# EasyEDA Pro project Complete_project.epro, board PCB7
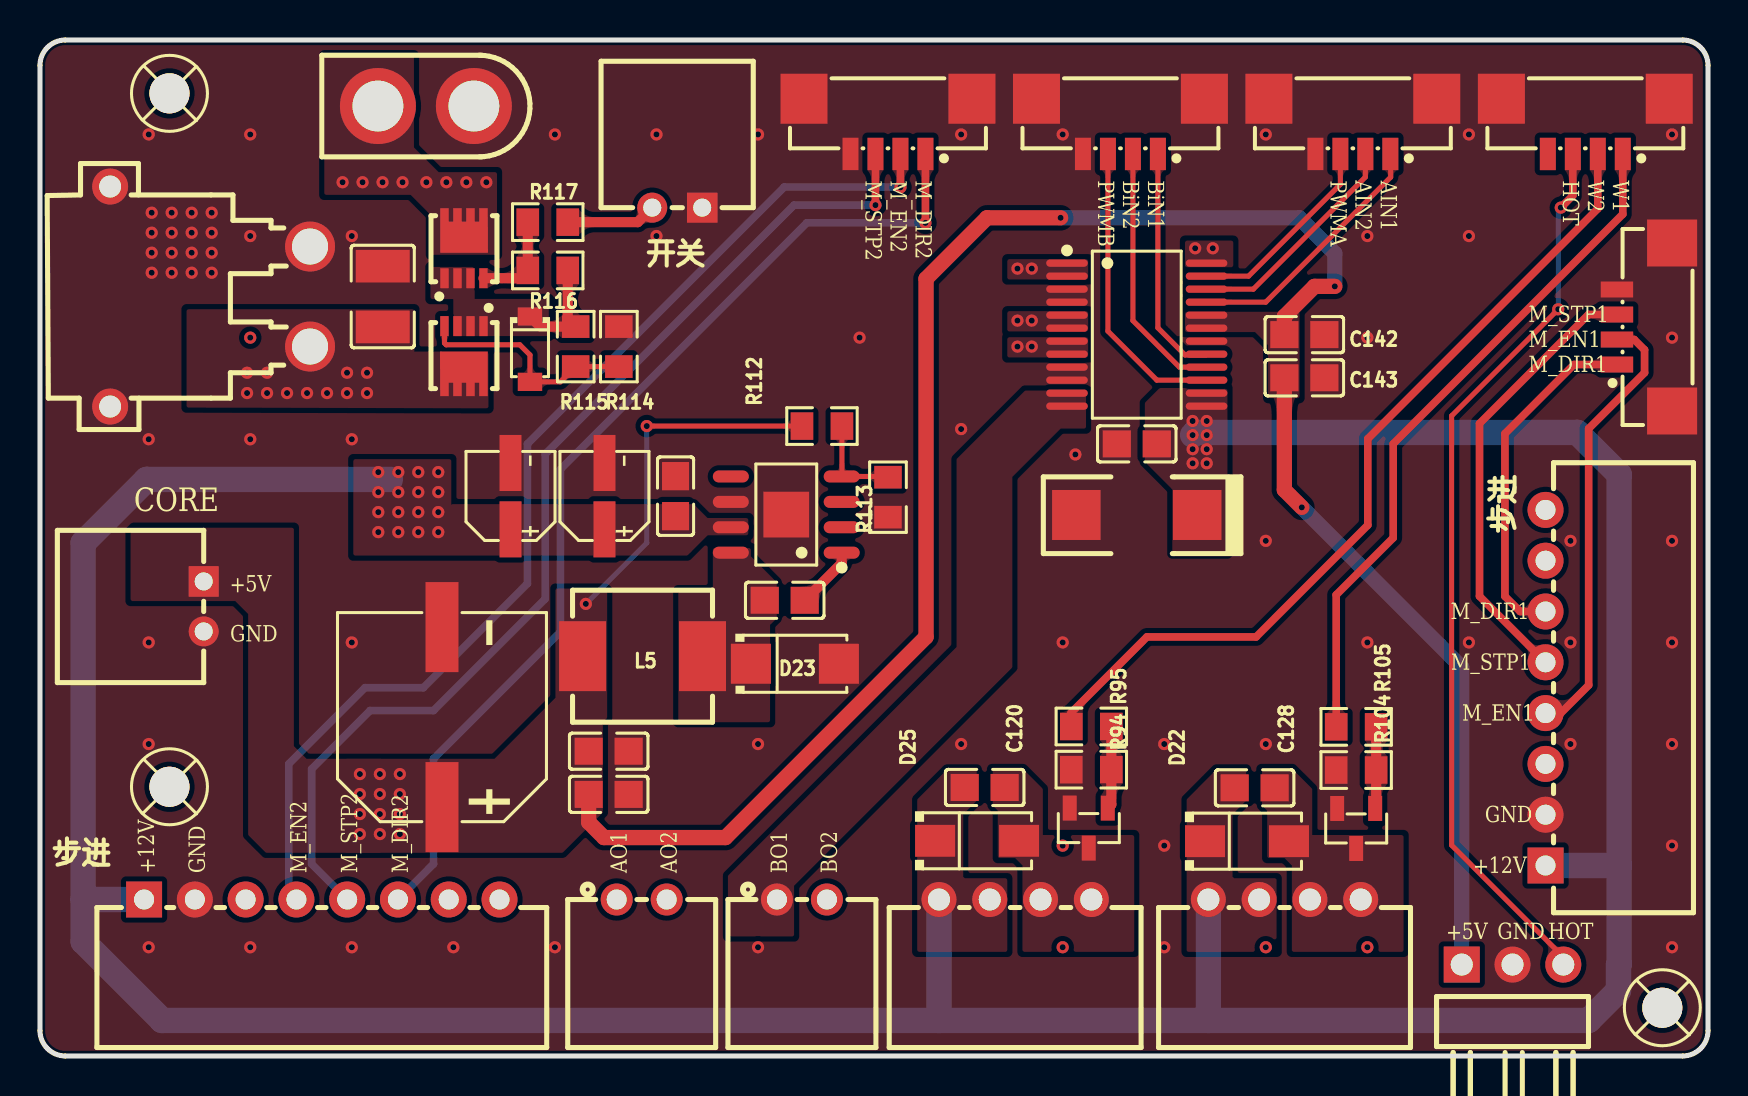
[diagram p18: board, top side]
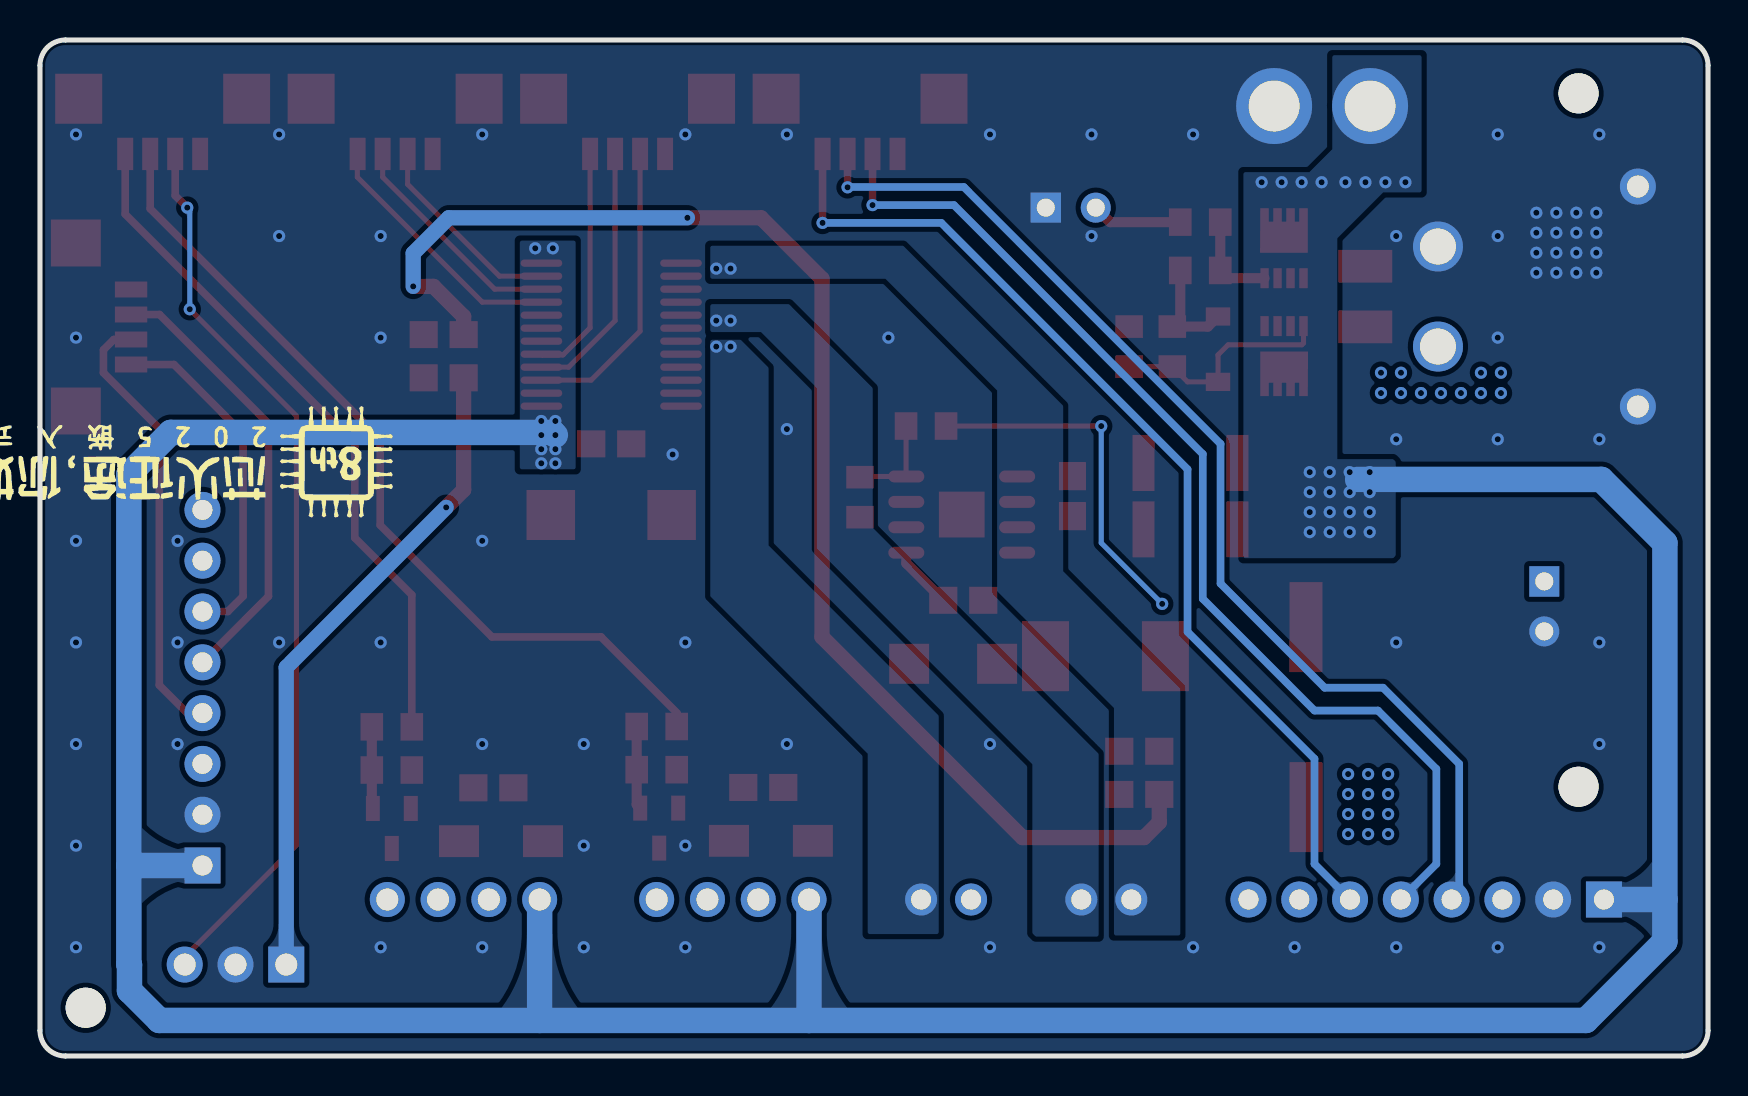
[diagram p19: board, bottom side, seen from below]

Outline 83.44 x 50.8 mm; copper layers: Top Layer, Bottom Layer. Coordinates in mm from the lower left corner of the outline.
Outline path: 0,49.53 0,1.27 arc(0.37,0.37) 1.27,0 82.17,0 arc(83.07,0.37) 83.44,1.27 83.44,49.53 arc(83.07,50.43) 82.17,50.8 1.27,50.8 arc(0.37,50.43) 0,49.53
Stack: Top Layer 0.035mm / Dielectric1 1.51mm FR4 er 4.5 / Bottom Layer 0.035mm

## Design rules (mm)
template: 自定义配置
spacing copperThickness1oz (default): track to track 0.102, other pairs 0.152 to 0.3
spacing copperThickness2oz: track to track 0.203, other pairs 0.152 to 0.3
track width copperThickness1oz (default): min 0.127, default 0.254, max 2.54
track width copperThickness2oz: min 0.203, default 0.254, max 2.54
differential pair differentialPair (default): width min 0.127, default 0.254, max 2.54; gap min 0.152, default 0.152
via viaSize (default): diameter min 0.5, default 0.61, max 10; hole min 0.3, default 0.305, max 6.3

## Placement (name value [footprint] x y rotation side)
C29  10uF  [CASE-C_6032]  54.86 27.05 0 top
C32  100nF  [C0805]  54.86 30.61 0 top
C120  100nF  [C0805]  47.26 13.43 180 top
C128  100nF  [C0805]  60.76 13.41 180 top
C131  4.7uF  [CAP-SMD_BD4.0-L4.3-W4.3-LS5.0-FD]  28.24 27.99 90 top
C132  100nF  [C0805]  31.79 27.99 270 top
C134  100nF  [C0805]  28.45 13.08 180 top
C135  470uF  [CAP-SMD_BD10.0-L10.3-W10.3-LS11.3-FD]  20.11 16.94 90 top
C136  100nF  [C0805]  28.45 15.24 180 top
C137  4.7uF  [CAP-SMD_BD4.0-L4.3-W4.3-LS5.0-FD]  23.54 27.99 90 top
C139  100nF  [C0805]  37.25 22.79 180 top
C141  100nF  [C1210]  17.14 37.97 90 top
C142  100nF  [C0805]  63.25 36.07 180 top
C143  100nF  [C0805]  63.25 33.91 180 top
CN16  ZX-XH2.54-2PWZ  [CONN-TH_2P-P2.50_ZX-XH2.54-2PWZ]  31.88 42.42 180 top
CN17  XT30PW-M30.G.Y  [CONN-TH_XT30PW-M]  8.51 37.97 270 top
CN113  HC-1.25-4PLT  [CONN-SMD_4P-P1.25_HCTL_HC-1.25-4PLT]  77.3 46.48 180 top
CN114  HC-1.25-4PLT  [CONN-SMD_4P-P1.25_HCTL_HC-1.25-4PLT]  65.67 46.48 180 top
CN115  HC-1.25-4PLT  [CONN-SMD_4P-P1.25_HCTL_HC-1.25-4PLT]  54.05 46.48 180 top
CN116  HC-1.25-4PLT  [CONN-SMD_4P-P1.25_HCTL_HC-1.25-4PLT]  80.26 36.45 90 top
CN117  HC-1.25-4PLT  [CONN-SMD_4P-P1.25_HCTL_HC-1.25-4PLT]  42.42 46.48 180 top
CN118  XH-2AW  [CONN-TH_XH-2AW_C2908611]  30.1 7.82 0 top
CN119  XH-2AW  [CONN-TH_XH-2AW_C2908611]  38.11 7.82 0 top
core1  ZX-XH2.54-2PWZ  [CONN-TH_2P-P2.50_ZX-XH2.54-2PWZ]  8.19 22.48 270 top
D22  SS34  [SMA_L4.3-W2.5-LS5.0-RD]  60.38 10.74 0 top
D23  SS56  [SMA_L4.3-W2.6-LS5.2-RD]  37.76 19.61 0 top
D24  BZT52C27  [SOD-123_L2.7-W1.6-LS3.7-RD]  24.51 35.34 270 top
D25  SS34  [SMA_L4.3-W2.5-LS5.0-RD]  46.88 10.76 0 top
H1  PZ254R-11-03P  [HDR-TH_3P-P2.54-H-M-W10.4]  73.66 4.57 0 top
L5  10uH  [IND-SMD_L7.3-W6.8]  30.14 19.99 180 top
Q21  AON7401-MS  [POWERDI3333-8_DMN7022LFGQ-7]  21.21 35.47 180 top
Q22  AON7401-MS  [POWERDI3333-8_DMN7022LFGQ-7]  21.21 39.91 0 top
Q23  -  [SOT-23-3_L2.9-W1.3-P1.90-LS2.4-BR]  65.84 11.38 90 top
Q24  -  [SOT-23-3_L2.9-W1.3-P1.90-LS2.4-BR]  52.46 11.4 90 top
R94  1k  [R0805]  52.59 14.32 0 top
R95  20  [R0805]  52.59 16.48 0 top
R104  1k  [R0805]  65.84 14.3 0 top
R105  20  [R0805]  65.84 16.46 0 top
R112  6.8K  [R0805]  39.12 31.5 180 top
R113  2.2K  [R0805]  42.42 27.94 90 top
R114  10K  [R0805]  28.96 35.47 270 top
R115  10K  [R0805]  26.8 35.47 270 top
R116  100K  [R0805]  25.4 39.28 180 top
R117  100R  [R0805]  25.4 41.69 0 top
SCREW1  -  [M2螺丝]  6.48 48.13 0 top
SCREW2  -  [M2螺丝]  6.48 13.46 0 top
SCREW3  -  [M2螺丝]  81.15 2.41 0 top
STEP2  XH-8AW  [CONN-TH_8P-P2.54_HCTL_XH-8AW_C2908617]  75.31 18.41 90 top
STEP3  XH-8AW  [CONN-TH_8P-P2.54_HCTL_XH-8AW_C2908617]  14.1 7.82 0 top
U1  TB6612FNG(O,C,8,EL  [SSOP-24_L8.4-W5.8-P0.65-LS7.8-BL]  54.86 36.07 270 top
U50  TPS5450DDAR  [SOP-8_L4.9-W3.9-P1.27-LS6.0-BL-EP]  37.33 27.07 90 top
U51  XT30U-F  [CONN-TH_XT30U-F]  19.3 47.5 0 top
WATER1  XH-4AW  [CONN-TH_XH-4AW]  62.26 7.82 0 top
WATER2  XH-4AW  [CONN-TH_XH-4AW]  48.78 7.82 0 top

## Footprints (pads in the part's own frame, mm; a bottom-side part is the same pattern mirrored in y, then rotated)
C0805
  rect 1.41x1.35 smd: 1(-1,0) 2(1,0)
C1210
  rect 1.635x2.7 smd: 1(-1.518,0) 2(1.518,0)
CAP-SMD_BD4.0-L4.3-W4.3-LS5.0-FD
  rect 2.8x1.1 smd: 1(-1.661,0) 2(1.661,0)
CAP-SMD_BD10.0-L10.3-W10.3-LS11.3-FD
  rect 4.5x1.65 smd: 1(-4.5,0) 2(4.5,0)
CASE-C_6032
  rect 2.425x2.5 smd: 1(3.022,0) 2(-3.022,0)
CONN-SMD_4P-P1.25_HCTL_HC-1.25-4PLT
  rect 0.8x1.62 smd: 1(-1.875,1.38) 2(-0.625,1.38) 3(0.625,1.38) 4(1.875,1.38)
  rect 2.35x2.5 smd: 5(-4.2,-1.38) 6(4.2,-1.38)
CONN-TH_2P-P2.50_ZX-XH2.54-2PWZ
  rect 1.524x1.5 hole 0.9: 1(-1.25,0)
  round 1.5 hole 0.9: 2(1.25,0)
CONN-TH_8P-P2.54_HCTL_XH-8AW_C2908617
  rect 1.8x1.8 hole 1: 1(-8.89,0)
  round 1.8 hole 1: 2(-6.35,0) 3(-3.81,0) 4(-1.27,0) 5(1.27,0) 6(3.81,0) 7(6.35,0) 8(8.89,0)
CONN-TH_XH-2AW_C2908611
  round 1.6 hole 1: 1(-1.25,0) 2(1.25,0)
CONN-TH_XH-4AW
  round 1.75 hole 1.1: 1(-3.81,0) 2(-1.27,0) 3(1.27,0) 4(3.81,0)
CONN-TH_XT30PW-M
  round 2.5 hole 1.8: 1(-2.5,5) 2(2.5,5)
  round 1.8 hole 1.1: 3(5.5,-5) 4(-5.5,-5)
CONN-TH_XT30U-F
  round 3.8 hole 2.54: 1(2.4,0) 2(-2.4,0)
HDR-TH_3P-P2.54-H-M-W10.4
  rect 1.8x1.8 hole 1.1: 1(-2.54,0)
  round 1.8 hole 1.1: 2(0,0) 3(2.54,0)
IND-SMD_L7.3-W6.8
  rect 2.35x3.5 smd: 1(-3,0) 2(3,0)
M2螺丝
  round 2 hole 2: 1(0,0)
POWERDI3333-8_DMN7022LFGQ-7
  rect 0.42x1 smd: 1(-0.975,-1.025) 2(-0.325,-1.025) 3(0.325,-1.025) 4(0.975,-1.025)
  custom 0x0 smd: 5(0.005,1.025)
R0805
  rect 1.133x1.377 smd: 1(-1,0) 2(1,0)
SMA_L4.3-W2.5-LS5.0-RD
  rect 2x1.593 smd: 1(-2.1,0) 2(2.1,0)
SMA_L4.3-W2.6-LS5.2-RD
  rect 2x2 smd: 1(-2.2,0) 2(2.2,0)
SOD-123_L2.7-W1.6-LS3.7-RD
  rect 0.91x1.22 smd: 1(-1.635,0) 2(1.635,0)
SOP-8_L4.9-W3.9-P1.27-LS6.0-BL-EP
  oval 0.6x1.8 smd: 1(-1.905,-2.772) 2(-0.635,-2.772) 3(0.635,-2.772) 4(1.905,-2.772) 5(1.905,2.772) 6(0.635,2.772) 7(-0.635,2.772) 8(-1.905,2.772)
  rect 2.29x2.29 smd: 9(0,0)
SOT-23-3_L2.9-W1.3-P1.90-LS2.4-BR
  rect 1.25x0.7 smd: 1(1,-0.95) 2(1,0.95) 3(-1,0)
SSOP-24_L8.4-W5.8-P0.65-LS7.8-BL
  oval 0.364x2.082 smd: 1(-3.575,-3.491) 2(-2.925,-3.491) 3(-2.275,-3.491) 4(-1.625,-3.491) 5(-0.975,-3.491) 6(-0.325,-3.491) 7(0.325,-3.491) 8(0.975,-3.491) 9(1.625,-3.491) 10(2.275,-3.491) 11(2.925,-3.491) 12(3.575,-3.491) 13(3.575,3.491) 14(2.925,3.491) 15(2.275,3.491) 16(1.625,3.491) 17(0.975,3.491) 18(0.325,3.491) 19(-0.325,3.491) 20(-0.975,3.491) 21(-1.625,3.491) 22(-2.275,3.491) 23(-2.925,3.491) 24(-3.575,3.491)

## Nets
As in the schematic.

Pads without a net: SCREW1 1; SCREW2 1; SCREW3 1; STEP2 3 7 8; STEP3 3 7 8; U50 2 3 5

## Via types
v1: diameter 0.61, hole 0.305, Top Layer to Bottom Layer, 144 vias

## Routing (per net, layer and track width the routed paths; a pad name or vN(x,y) marks a point on that pad's centre or on a via; arc(x,y) is an arc through that point)
+5V: length 119.7
  Top Layer w0.254: R112.2 v1(30.35,31.5)
  Top Layer w0.762: C134.2 27.45,11.68 28.21,10.92 34.29,10.92 44.32,20.95 44.32,38.86 47.37,41.91 v1(51.05,41.91) ; v1(64.77,38.48) 63.75,38.48 62.25,36.97 C142.2 ; v1(63.12,27.43) 62.25,28.3 C143.2
  Bottom Layer w0.254: v1(30.35,31.5) 30.35,25.65 v1(27.31,22.61)
  Bottom Layer w0.762: H1.1 71.12,19.43 v1(63.12,27.43) ; v1(64.77,38.48) 64.77,40.13 62.99,41.91 v1(51.05,41.91)
  vias: v1(16,14.1) v1(16,13.1) v1(16,12.1) v1(16,11.1) v1(17,14.1) v1(17,13.1) v1(17,12.1) v1(17,11.1) v1(18,14.1) v1(18,13.1) v1(18,12.1) v1(18,11.1)
+12V: length 182.6
  Bottom Layer w1.27: 17.53,28.83 5.33,28.83 2.16,25.65 2.16,7.82 ; STEP3.1 2.16,7.82 ; 2.16,7.82 2.16,5.72 6.11,1.78 44.97,1.78 ; v1(57.66,31.04) 57.79,31.18 76.9,31.18 78.99,29.08 78.99,9.52 ; WATER1.1 58.45,1.78 ; 44.97,1.78 77.47,1.78 78.96,3.27 78.96,4.56 78.99,4.59 78.99,9.52 ; 44.97,1.78 WATER2.1 ; STEP2.1 78.99,9.52
  vias: v1(15.14,43.69) v1(16.14,43.69) v1(16.92,29.19) v1(16.92,28.19) v1(16.92,27.19) v1(16.92,26.19) v1(17.14,43.69) v1(17.92,29.19) v1(17.92,28.19) v1(17.92,27.19) v1(17.92,26.19) v1(18.14,43.69) v1(18.92,29.19) v1(18.92,28.19) v1(18.92,27.19) v1(18.92,26.19) v1(19.33,43.69) v1(19.92,29.19) v1(19.92,28.19) v1(19.92,27.19) v1(19.92,26.19) v1(20.33,43.69) v1(21.33,43.69) v1(22.33,43.69) v1(57.66,31.75) v1(57.66,30.34) v1(57.66,29.63) v1(57.78,40.39) v1(58.36,31.75) v1(58.36,31.04) v1(58.36,30.34) v1(58.36,29.63) v1(58.67,40.39)
GND:
  vias: v1(5.44,46.08) v1(5.44,30.84) v1(5.44,20.68) v1(5.44,15.6) v1(5.44,5.44) v1(5.59,42.16) v1(5.59,41.16) v1(5.59,40.16) v1(5.59,39.16) v1(6.59,42.16) v1(6.59,41.16) v1(6.59,40.16) v1(6.59,39.16) v1(7.59,42.16) v1(7.59,41.16) v1(7.59,40.16) v1(7.59,39.16) v1(8.59,42.16) v1(8.59,41.16) v1(8.59,40.16) v1(8.59,39.16) v1(10.52,46.08) v1(10.52,41) v1(10.52,35.92) v1(10.52,30.84) v1(10.52,5.44) v1(15.6,41) v1(15.6,30.84) v1(15.6,20.68) v1(15.6,5.44) v1(20.68,5.44) v1(25.76,46.08) v1(25.76,5.44) v1(30.84,46.08) v1(30.84,41) v1(35.92,46.08) v1(35.92,15.6) v1(35.92,5.44) v1(41,35.92) v1(46.08,46.08) v1(46.08,31.35) v1(46.08,15.6) v1(51.16,46.08) v1(51.16,20.68) v1(51.16,10.52) v1(51.16,5.44) v1(51.79,30.08) v1(56.24,15.6) v1(56.24,10.52) v1(56.24,5.44) v1(61.32,46.08) v1(61.32,25.76) v1(61.32,15.6) v1(61.32,5.44) v1(66.4,41) v1(66.4,35.92) v1(66.4,20.68) v1(66.4,5.44) v1(71.48,46.08) v1(71.48,41) v1(71.48,20.68) v1(76.56,25.76) v1(76.56,20.68) v1(76.56,15.6) v1(81.64,46.08) v1(81.64,35.92) v1(81.64,25.76) v1(81.64,20.68) v1(81.64,15.6) v1(81.64,10.52) v1(81.64,5.44)
AIN1: length 13
  Top Layer w0.254: U1.21 61.31,37.69 67.56,43.94 67.56,45.09 CN114.1
AIN2: length 11.4
  Top Layer w0.254: 58.35,38.34 60.69,38.34 66.3,43.95 CN114.2
AO1:
  vias: v1(48.9,39.37) v1(49.61,39.37)
AO2:
  vias: v1(48.9,36.77) v1(49.61,36.77)
BIN1: length 11.7
  Top Layer w0.254: CN115.1 55.92,36.41 57.28,35.05 58.31,35.05 U1.17
BIN2: length 13
  Top Layer w0.254: U1.16 57,34.44 54.67,36.77 CN115.2
BO2:
  vias: v1(48.9,35.47) v1(49.61,35.47)
HOT: length 45.4
  Top Layer w0.254: H1.3 76.2,4.95 70.61,10.54 70.61,32 v1(75.95,37.34)
  Top Layer w0.381: CN113.3 76.68,43.02 v1(76.07,42.42)
  Bottom Layer w0.254: v1(76.07,42.42) 75.95,42.29 v1(75.95,37.34)
INPUT:
  vias: v1(10.36,34.16) v1(10.36,33.15) v1(11.36,34.16) v1(11.36,33.15) v1(12.36,33.15) v1(13.36,33.15) v1(14.36,33.15) v1(15.36,34.16) v1(15.36,33.15) v1(16.36,34.16) v1(16.36,33.15)
M_DIR1: length 17.5
  Top Layer w0.381: 78.88,34.57 76.74,34.57 73.28,31.11 73.28,22.99 74.04,22.22 STEP2.6
M_DIR2: length 51.7
  Top Layer w0.381: CN117.1 v1(44.29,41.66)
  Bottom Layer w0.381: 44.32,41.66 38.35,41.66 26.03,29.34 26.03,21.21 19.69,14.86 19.69,9.6 STEP3.6
M_EN1: length 22.3
  Top Layer w0.381: STEP2.4 76.07,17.14 77.47,18.54 77.47,31.37 80.26,34.16 80.26,35.31 79.75,35.82 78.88,35.82
M_EN2: length 55.2
  Top Layer w0.381: CN117.2 v1(43.04,43.43)
  Bottom Layer w0.381: v1(43.04,43.43) 43.03,43.45 37.23,43.45 24.38,30.61 24.38,23.62 19.18,18.41 16.26,18.41 12.45,14.6 12.45,8.21 STEP3.4
M_STP1: length 22.4
  Top Layer w0.381: 78.88,37.07 77.46,37.07 72.01,31.62 72.01,22.99 STEP2.5
M_STP2: length 53.9
  Top Layer w0.381: CN117.3 v1(41.79,42.54)
  Bottom Layer w0.381: STEP3.5 13.59,9.6 13.59,14.35 16.51,17.27 19.69,17.27 25.27,22.86 25.27,30.1 37.72,42.54 v1(41.79,42.54)
PWMA: length 10.1
  Top Layer w0.254: CN114.3 65.05,43.59 60.46,38.99 U1.23
PWMB: length 14.8
  Top Layer w0.254: CN115.3 53.42,36.24 55.87,33.79 U1.15
PWR_ON: length 4.5
  Top Layer w0.508: CN16.2 29.9,41.69 R117.2
WATER1: length 34.6
  Top Layer w0.381: R105.1 64.84,23.06 67.69,25.91 67.69,30.61 79.18,42.09 CN113.1
WATER2: length 42.1
  Top Layer w0.381: 51.56,17.14 55.37,20.95 60.83,20.95 66.42,26.54 66.42,30.86 77.93,42.37 CN113.2
$1N1334: length 4.2
  Top Layer w0.508: R95.2 R94.2 53.59,12.57 Q24.1
$1N1335: length 4.1
  Top Layer w0.508: R105.2 R104.2 66.84,12.43 Q23.1
$2N1103: length 11.5
  Top Layer w0.254: R114.2 R115.2 26.03,33.71 D24.2 24.51,35.05 24,35.56 20.32,35.56 20.23,35.65 Q21.4
$2N1105: length 5.5
  Top Layer w0.508: R116.1 26.4,36.87 R115.1 25.02,36.47 D24.1
$2N1113: length 4.8
  Top Layer w0.508: R117.1 R116.2 24.01,38.89 Q22.4
$2N1120: length 4.9
  Top Layer w0.254: R112.1 40.12,28.99 U50.4 42.38,28.98 R113.2
$2N1125: length 3.1
  Top Layer w0.508: U50.1 40.1,24.63 C139.1

## Copper pours and planes (outline as drawn; the poured copper is in the pictures)
+5V on Top Layer: 57.28,37.21 63,37.21 63,32.89 61.44,32.89 61.44,35.54 60.78,36.2 57.27,36.2 57.28,36.2
+5V on Top Layer: 28.37,23.29 28.37,16.9 28.16,16.69 28.16,12.18 26.14,10.16 15.24,10.16 15.24,14.86 22.73,14.86 25.78,17.91 25.78,23.37 28.29,23.37
+5V on Top Layer: 17.14,14.86 13.33,14.86 12.7,15.49 12.7,26.42 4.7,26.42 4.53,26.25 4.53,22.75 9.76,22.75 10.41,22.1 10.41,11.05 11.3,10.16 17.02,10.16 17.14,10.29
+12V on Top Layer: 57.36,5.21 57.36,12.83 58.86,14.33 60.33,14.33 60.33,12.76 59.65,12.08 59.65,8.97 59.73,8.89 61.86,8.89 61.86,5.21
+12V on Top Layer: 56.64,25.12 56.64,28.33 55.26,29.7 55.26,32.66 56.01,33.4 59.4,33.4 59.4,25.12
+12V on Top Layer: 19.56,40.06 19.56,42.04 18.54,43.05 14.22,43.05 14.22,50.04 18.7,50.04 18.7,45.43 19.94,44.2 22.86,44.2 22.86,40.06
+12V on Top Layer: 43.88,5.21 43.88,12.83 45.38,14.33 46.86,14.33 46.86,12.76 46.18,12.08 46.18,8.97 46.26,8.89 48.39,8.89 48.39,5.21
+12V on Top Layer: 57.28,40.77 59.69,40.77 59.69,39.44 57.28,39.44
+12V on Top Layer: 35.45,26.9 33.39,26.9 32.7,27.59 20.61,27.59 20.57,27.56 20.57,29.84 15.67,29.84 15.67,25.02 32.38,25.02 33.4,26.03 35.43,26.03 35.43,26.88
+12V on Bottom Layer: 14.33,50.04 14.33,43.18 16.25,43.18 18.54,40.88 18.54,29.84 15.75,29.84 15.62,29.72 15.62,25.02 15.75,24.89 23.24,24.89 23.24,44.2 19.94,44.2 18.8,45.34 18.8,50.04
+12V on Bottom Layer: 56.64,29.34 56.64,40.77 59.44,40.77 59.44,29.34
GND on Top Layer: -3.94,56.9 87.63,56.9 87.63,-2.54 -3.94,-2.54
GND on Bottom Layer: -3.94,56.39 87,56.39 87,-2.41 -3.94,-2.41
AO1 on Top Layer: 48.39,38.82 48.39,39.84 52.43,39.84 52.43,38.82
AO1 on Bottom Layer: 49.91,38.86 41.15,38.86 35.56,33.27 35.56,23.24 29.72,17.4 29.72,6.02 26.4,6.02 26.4,18.38 32.26,24.24 32.26,32.51 40.26,40.51 49.91,40.51
AO2 on Top Layer: 48.39,36.22 48.39,37.24 52.43,37.24 52.43,36.22
AO2 on Bottom Layer: 49.91,36.19 47.37,36.19 44.58,33.4 44.58,25.37 33.8,14.59 33.8,6.14 33.63,5.97 30.48,5.97 30.48,15.11 41.78,26.42 41.78,33.4 45.97,37.59 49.91,37.59
BO1 on Top Layer: 52.32,33.27 49.28,33.27 45.85,29.84 45.85,20.45 34.41,9.01 34.41,5.98 37.72,5.98 37.72,8.51 48.64,19.43 48.64,28.96 51.05,31.37 52.32,31.37
BO2 on Top Layer: 48.39,34.92 48.39,35.94 52.43,35.94 52.43,34.92
BO2 on Bottom Layer: 49.91,35.81 48.39,35.81 46.99,34.42 46.99,25.53 38.48,17.02 38.48,6.1 42.04,6.1 42.04,15.11 49.91,22.99
INPUT on Top Layer: 7.33,37.34 18.72,37.34 18.72,35.22 22.44,35.22 22.44,32.38 7.33,32.42
$1N1337 on Top Layer: 62.62,5.21 62.62,9.53 62.26,9.89 61.39,9.89 61.39,12.27 61.13,12.52 61.13,14.32 61.1,14.35 62.65,14.35 63.64,13.36 63.64,11.05 68.21,11.05 68.21,5.21
$1N1338 on Top Layer: 49.15,5.21 49.15,9.53 48.78,9.89 47.91,9.89 47.91,12.27 47.66,12.52 47.66,14.32 47.62,14.35 49.18,14.35 50.16,13.36 50.16,11.05 54.74,11.05 54.74,5.21
$2N1105 on Top Layer: 25.45,37.85 25.45,35.99 20.67,35.99 20.67,37.85 19.53,37.85 19.53,39.45 21.74,39.45 21.74,37.85
$2N1124 on Top Layer: 33.66,25.4 33.66,23.29 31.93,23.29 31.93,16.69 36.52,16.69 36.52,21.55 36.85,21.88 36.85,23.69 35.56,24.98 35.56,25.4

Small or netless copper shapes (teardrops, artwork), in the pictures only: 67 on Top Layer, 19 on Bottom Layer

## Text on the board
Top Silkscreen Layer: +12V | GND | M_EN2 | M_STP2 | M_DIR2 | PWMB | BiN2 | BiN1 | PWMA | AIN2 | AIN1 | HOT | W2 | W1 | +5V | M_DIR1 | M_STP1 | M_EN1 | AO1 | AO2 | BO1 | BO2 | 步进 | CORE | 开关
